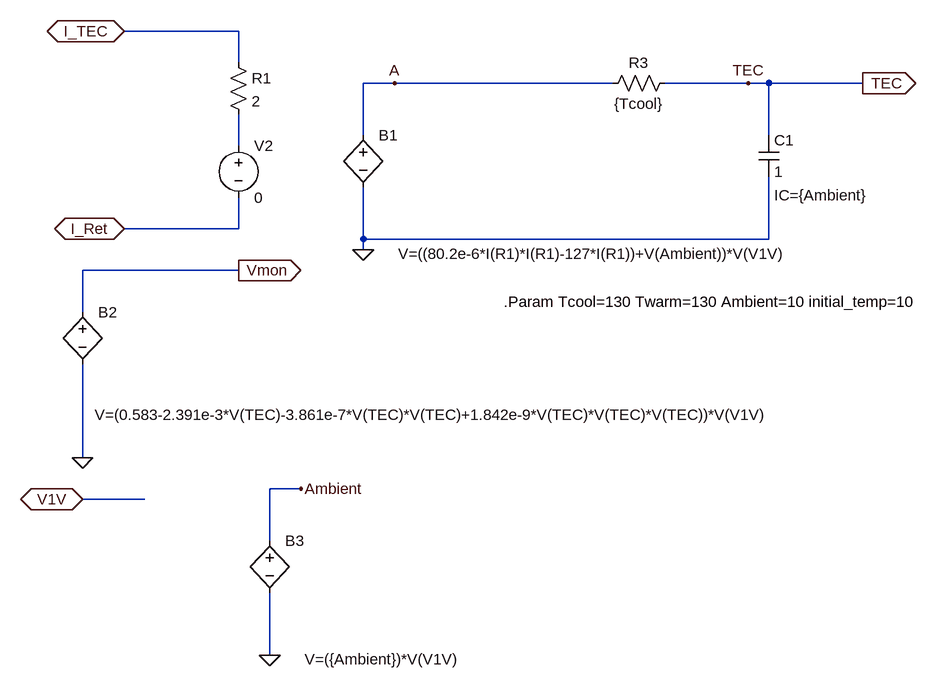
[diagram p0: schematic TEC_block1.asc]
TEC_block1.asc, the LTspice schematic file:
Version 4
SHEET 1 880 1016
WIRE -960 464 -960 400
WIRE -960 688 -960 544
WIRE -864 752 -960 752
WIRE -720 32 -896 32
WIRE -720 80 -720 32
WIRE -720 208 -720 160
WIRE -720 336 -896 336
WIRE -720 336 -720 288
WIRE -720 400 -960 400
WIRE -672 816 -672 736
WIRE -672 992 -672 896
WIRE -624 736 -672 736
WIRE -528 192 -528 112
WIRE -528 352 -528 272
WIRE -528 368 -528 352
WIRE -480 112 -528 112
WIRE -144 112 -480 112
WIRE 64 112 -64 112
WIRE 96 112 64 112
WIRE 96 192 96 112
WIRE 96 352 -528 352
WIRE 96 352 96 256
WIRE 240 112 96 112
FLAG -528 368 0
FLAG 64 112 TEC
FLAG -960 688 0
FLAG -720 400 Vmon
IOPIN -720 400 Out
FLAG 240 112 TEC
IOPIN 240 112 Out
FLAG -896 32 I_TEC
IOPIN -896 32 BiDir
FLAG -896 336 I_Ret
IOPIN -896 336 BiDir
FLAG -480 112 A
FLAG -960 752 V1V
IOPIN -960 752 BiDir
FLAG -672 992 0
FLAG -624 736 Ambient
SYMBOL res -736 64 R0
SYMATTR InstName R1
SYMATTR Value 2
SYMBOL cap 80 192 R0
WINDOW 123 24 92 Left 0
SYMATTR Value2 IC={Ambient}
SYMATTR InstName C1
SYMATTR Value 1
SYMBOL res -48 96 R90
WINDOW 0 0 56 VBottom 0
WINDOW 3 32 56 VTop 0
SYMATTR InstName R3
SYMATTR Value {Tcool}
SYMBOL voltage -720 192 R0
WINDOW 123 0 0 Left 0
WINDOW 39 0 0 Left 0
SYMATTR InstName V2
SYMATTR Value 0
SYMBOL bv -528 176 R0
WINDOW 3 54 198 Left 0
SYMATTR Value V=((80.2e-6*I(R1)*I(R1)-127*I(R1))+V(Ambient))*V(V1V)
SYMATTR InstName B1
SYMBOL bv -960 448 R0
WINDOW 3 19 174 Left 0
SYMATTR Value V=(0.583-2.391e-3*V(TEC)-3.861e-7*V(TEC)*V(TEC)+1.842e-9*V(TEC)*V(TEC)*V(TEC))*V(V1V)
SYMATTR InstName B2
SYMBOL bv -672 800 R0
WINDOW 3 54 198 Left 0
SYMATTR Value V=({Ambient})*V(V1V)
SYMATTR InstName B3
TEXT -312 448 Left 0 !.Param Tcool=130 Twarm=130 Ambient=10 initial_temp=10

The netlist it stands for:
* TEC_block1.asc
R1 I_TEC N001 2
C1 TEC 0 1 IC={Ambient}
R3 TEC A {Tcool}
V2 N001 I_Ret 0
B1 A 0 V=((80.2e-6*I(R1)*I(R1)-127*I(R1))+V(Ambient))*V(V1V)
B2 Vmon 0 V=(0.583-2.391e-3*V(TEC)-3.861e-7*V(TEC)*V(TEC)+1.842e-9*V(TEC)*V(TEC)*V(TEC))*V(V1V)
B3 Ambient 0 V=({Ambient})*V(V1V)
.Param Tcool=130 Twarm=130 Ambient=10 initial_temp=10
.backanno
.end